# Altium schematic sheet AUDIO.SchDoc
size A4
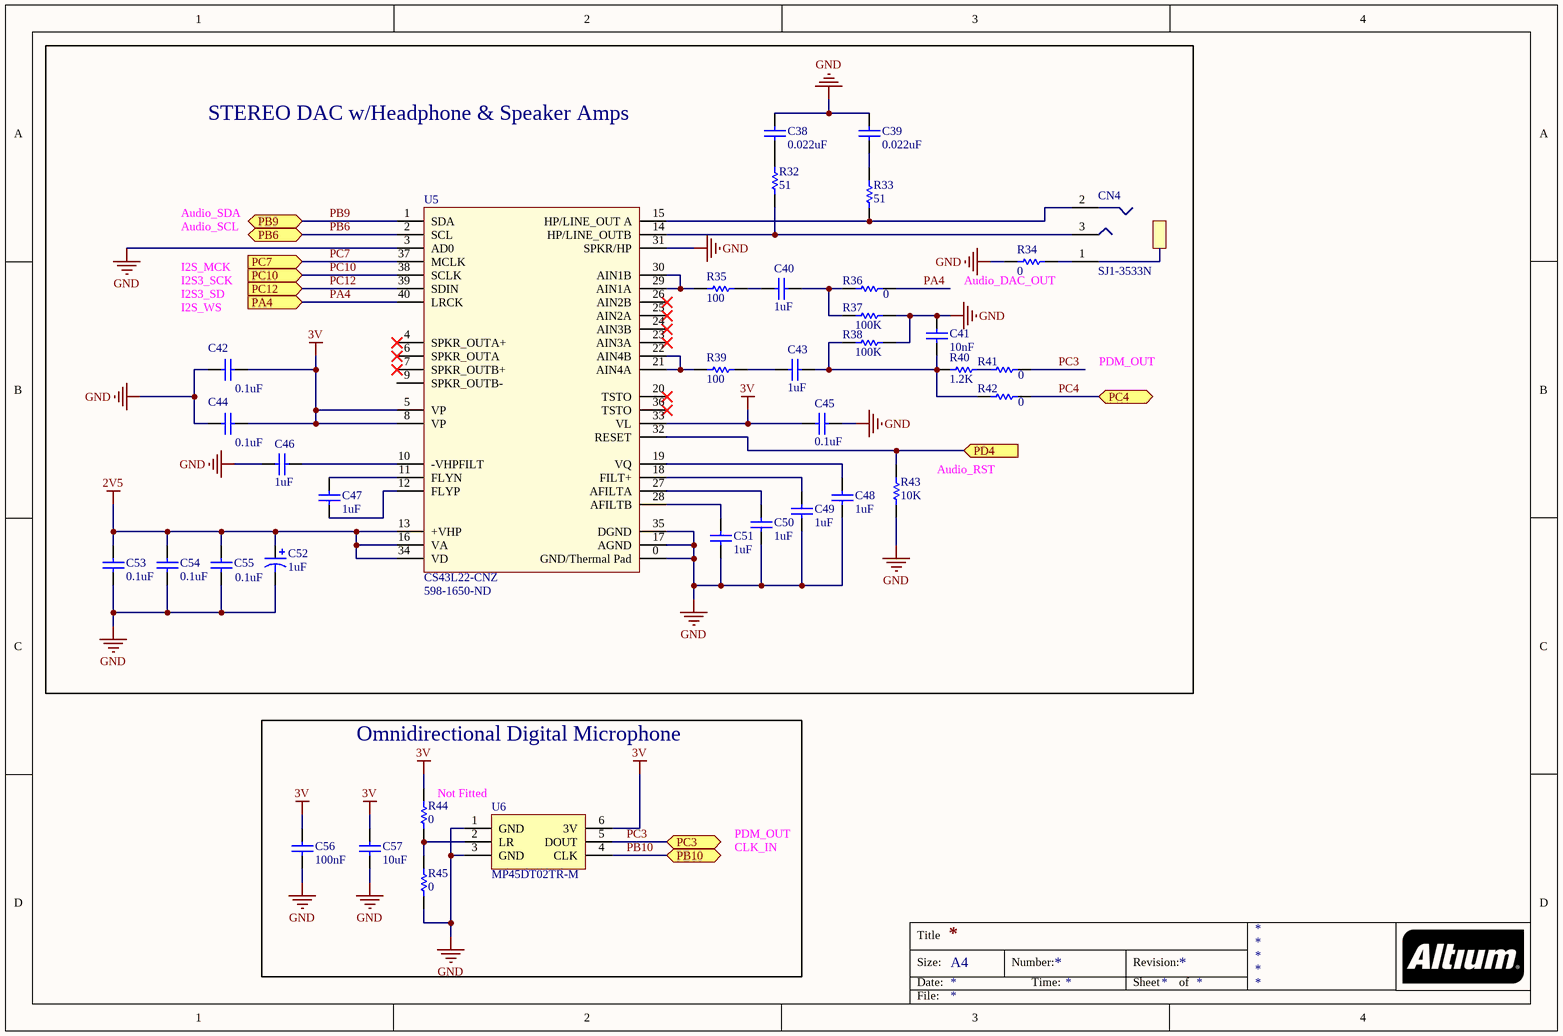
[diagram p0: AUDIO.SchDoc]

## Parts
C38  value 0.022uF  [CAPC0402B]  (hidden comment: Cap)
C39  value 0.022uF  [CAPC0402B]  (hidden comment: Cap)
C40  value 1uF  [CAPC0603B]  (hidden comment: Cap)
C41  value 10nF  [CAPC0402B]  (hidden comment: Cap)
C42  value 0.1uF  [CAPC0402B]  (hidden comment: Cap)
C43  value 1uF  [CAPC0603B]  (hidden comment: Cap)
C44  value 0.1uF  [CAPC0402B]  (hidden comment: Cap)
C45  value 0.1uF  [CAPC0402B]  (hidden comment: Cap)
C46  value 1uF  [CAPC0603B]  (hidden comment: Cap)
C47  value 1uF  [CAPC0603B]  (hidden comment: Cap)
C48  value 1uF  [CAPC0603B]  (hidden comment: Cap)
C49  value 1uF  [CAPC0603B]  (hidden comment: Cap)
C50  value 1uF  [CAPC0603B]  (hidden comment: Cap)
C51  value 1uF  [CAPC0603B]  (hidden comment: Cap)
C52  value 1uF  [TANTALUM CASE A_LEVEL B]  (hidden comment: Cap Pol1)
C53  value 0.1uF  [CAPC0402B]  (hidden comment: Cap)
C54  value 0.1uF  [CAPC0402B]  (hidden comment: Cap)
C55  value 0.1uF  [CAPC0402B]  (hidden comment: Cap)
C56  value 100nF  [CAPC0603B]  (hidden comment: Cap)
C57  value 10uF  [CAPC0402B]  (hidden comment: Cap)
CN4  SJ1-3533N  [SJ1-3533N]
R32  value 51  [RESC0402B]  (hidden comment: Res1)
R33  value 51  [RESC0402B]  (hidden comment: Res1)
R34  value 0  [RESC0603B]  (hidden comment: Res1)
R35  value 100  [RESC0402B]  (hidden comment: Res1)
R36  value 0  [RESC0603B]  (hidden comment: Res1)
R37  value 100K  [RESC0402B]  (hidden comment: Res1)
R38  value 100K  [RESC0402B]  (hidden comment: Res1)
R39  value 100  [RESC0402B]  (hidden comment: Res1)
R40  value 1.2K  [RESC0402B]  (hidden comment: Res1)
R41  value 0  [RESC0603B]  (hidden comment: Res1)
R42  value 0  [RESC0603B]  (hidden comment: Res1)
R43  value 10K  [RESC0603B]  (hidden comment: Res1)
R44  value 0  [RESC0603B]  (hidden comment: Res1)
R45  value 0  [RESC0603B]  (hidden comment: Res1)
U5  CS43L22-CNZ  Supplier Part Number 1: 598-1650-ND  [40QFN]
U6  MP45DT02TR-M  [MP45DT02TR]

## Blocks framed on the sheet
STEREO DAC w/Headphone & Speaker Amps: C38-C55 CN4 R32-R43 U5
Omnidirectional Digital Microphone: C56 C57 R44 R45 U6

## Ports
PA4 (in), PB6 (bidir), PB9 (bidir), PB10 (bidir), PC3 (bidir), PC4 (bidir), PC7 (in), PC10 (in), PC12 (in), PD4 (in)

## Nets
2V5: C52.1 C53.2 C54.2 C55.2 U5.13(+VHP) U5.16(VA) U5.34(VD)
3V: C42.2 C44.2 C45.2 C56.2 C57.2 R44.2 U5.5(VP) U5.8(VP) U5.33(VL) U6.6(3V)
GND: C38.2 C39.2 C41.2 C42.1 C44.1 C45.1 C46.1 C48.2 C49.2 C50.2 C51.1 C52.2 C53.1 C54.1 C55.1 C56.1 C57.1 R34.1 R37.2 R38.2 R43.1 R45.1 U5.0(GND/Thermal_Pad) U5.3(AD0) U5.17(AGND) U5.31(SPKR/HP) U5.35(DGND) U6.1(GND) U6.3(GND)
PA4: R36.2 U5.40(LRCK) ; port PA4
PB6: U5.2(SCL) ; port PB6
PB9: U5.1(SDA) ; port PB9
PB10: U6.4(CLK) ; port PB10
PC3: R41.2 U6.5(DOUT) ; port PC3
PC4: R42.2 ; port PC4
PC7: U5.37(MCLK) ; port PC7
PC10: U5.38(SCLK) ; port PC10
PC12: U5.39(SDIN) ; port PC12
PD4: R43.2 U5.32(RESET) ; port PD4
NetC38_1: C38.1 R32.2
NetC39_1: C39.1 R33.2
NetC40_1: C40.1 R35.1
NetC40_2: C40.2 R36.1 R37.1
NetC41_1: C41.1 C43.2 R38.1 R40.1 R42.1
NetC43_1: C43.1 R39.1
NetC46_2: C46.2 U5.10(-VHPFILT)
NetC47_1: C47.1 U5.12(FLYP)
NetC47_2: C47.2 U5.11(FLYN)
NetC48_1: C48.1 U5.19(VQ)
NetC49_1: C49.1 U5.18(FILT+)
NetC50_1: C50.1 U5.27(AFILTA)
NetC51_2: C51.2 U5.28(AFILTB)
NetCN4_1: CN4.1 R34.2
NetCN4_2: CN4.2 R33.1 U5.15(HP/LINE_OUT_A)
NetCN4_3: CN4.3 R32.1 U5.14(HP/LINE_OUTB)
NetR35_2: R35.2 U5.29(AIN1A) U5.30(AIN1B)
NetR39_2: R39.2 U5.21(AIN4A) U5.22(AIN4B)
NetR40_2: R40.2 R41.1
NetR44_1: R44.1 R45.2 U6.2(LR)

Not connected (* = marked no-connect by the designer): U5 4(SPKR_OUTA+)* 6(SPKR_OUTA)* 7(SPKR_OUTB+)* 9(SPKR_OUTB-) 20(TSTO)* 23(AIN3A)* 24(AIN3B)* 25(AIN2A)* 26(AIN2B)* 36(TSTO)*

## Notes on the sheet
- Audio_SDA
- Audio_SCL
- I2S_MCK
- I2S3_SCK
- I2S3_SD
- I2S_WS
- (near R34) Audio_DAC_OUT
- PDM_OUT
- (near R43) Audio_RST
- (near R44) Not Fitted
- CLK_IN
- Title
- Size:
- Date:
- A4
- Number:
- Time:
- Revision:
- Sheet
- of
- File:

## Library data of the parts
C38 C39 = Cap_8: Capacitor; Published: 8-Jun-2000; LatestRevisionDate: 17-Jul-2002; LatestRevisionNote: Re-released for DXP Platform.; PackageReference: RAD-0.3; Publisher: Altium Limited; PackageDescription: Radial Cap, Thru-Hole; 2 Leads; 0.3 in Pin Spacing
C40 C43 C46-C51 = Cap_4: Capacitor; Published: 8-Jun-2000; LatestRevisionDate: 17-Jul-2002; LatestRevisionNote: Re-released for DXP Platform.; PackageReference: RAD-0.3; Publisher: Altium Limited; PackageDescription: Radial Cap, Thru-Hole; 2 Leads; 0.3 in Pin Spacing
C41 = Cap_7: Capacitor; Published: 8-Jun-2000; LatestRevisionDate: 17-Jul-2002; LatestRevisionNote: Re-released for DXP Platform.; PackageReference: RAD-0.3; Publisher: Altium Limited; PackageDescription: Radial Cap, Thru-Hole; 2 Leads; 0.3 in Pin Spacing
C42 C44 C45 C53-C55 = Cap_6: Capacitor; Published: 8-Jun-2000; LatestRevisionDate: 17-Jul-2002; LatestRevisionNote: Re-released for DXP Platform.; PackageReference: RAD-0.3; Publisher: Altium Limited; PackageDescription: Radial Cap, Thru-Hole; 2 Leads; 0.3 in Pin Spacing
C52 = Cap Pol1: Polarized Capacitor (Radial); Published: 8-Jun-2000; LatestRevisionDate: 17-Jul-2002; LatestRevisionNote: Re-released for DXP Platform.; PackageReference: RB7.6-15; Publisher: Altium Limited; PackageDescription: Polarized Capacitor (Radial); 2 Leads
C56 = Cap_3: Capacitor; Published: 8-Jun-2000; LatestRevisionDate: 17-Jul-2002; LatestRevisionNote: Re-released for DXP Platform.; PackageReference: RAD-0.3; Publisher: Altium Limited; PackageDescription: Radial Cap, Thru-Hole; 2 Leads; 0.3 in Pin Spacing
C57 = Cap_5: Capacitor; Published: 8-Jun-2000; LatestRevisionDate: 17-Jul-2002; LatestRevisionNote: Re-released for DXP Platform.; PackageReference: RAD-0.3; Publisher: Altium Limited; PackageDescription: Radial Cap, Thru-Hole; 2 Leads; 0.3 in Pin Spacing
CN4 = PHONE JACK 3.5mm: 3.50mm (0.141", 1/8", Mini Plug) - Headphone Phone Jack Stereo Connector Solder; Manufacturer: CUI; Gender: Female; Actual Diameter: 0.142" (3.60mm); Number of Positions/Contacts: 3 Conductors, 3 Contacts; Internal Switch(s): Does Not Contain Switch; Shielding: Unshielded; Voltage - Rated: 12VDC; Current Rating: 1A; Mating Length/Depth: 0.551" (14.00mm); Body Material: Brass; Body Color: Silver, Black; Includes: 1 pc - 1 Connector; Supplier 1: Digikey; Manufacturer Part Number: SJ1-3533N; Stock 1: 8782; Pricing 1: 1=1.22, 10=1.076, 25=1.0128, 50=0.9706, 100=0.9284, 250=0.844, 500=0.7596, 1000=0.6752, 2500=0.6119 (USD); Category: Connectors, Interconnects; Family: Barrel - Audio Connectors; Series: SJ1; Packaging: Bulk; Connector Type: Phone Jack; Signal Lines: Stereo; Industry Recognized Mating Diameter: 3.50mm (0.141", 1/8", Mini Plug) - Headphone; Mounting Type: Through Hole, Right Angle; Termination: Solder; Features: -; Insulation Color: -; Contact Material - Plating: Tin; ComponentLink1URL: https://datasheet.ciiva.com/16381/sj1-353xn-series-16381818.pdf; ComponentLink1Description: https://datasheet.ciiva.com/16381/sj1-353xn-series-16381818.pdf
R32 R33 = Res1_8: Resistor; Published: 8-Jun-2000; LatestRevisionDate: 17-Jul-2002; LatestRevisionNote: Re-released for DXP Platform.; PackageReference: AXIAL-0.3; Publisher: Altium Limited; PackageDescription: Axial Device, Thru-Hole; 2 Leads; 0.3 in Pin Spacing
R34 R36 R41 R42 R44 R45 = Res1: Resistor; Published: 8-Jun-2000; LatestRevisionDate: 17-Jul-2002; LatestRevisionNote: Re-released for DXP Platform.; PackageReference: AXIAL-0.3; Publisher: Altium Limited; PackageDescription: Axial Device, Thru-Hole; 2 Leads; 0.3 in Pin Spacing
R35 R39 = Res1_4: Resistor; Published: 8-Jun-2000; LatestRevisionDate: 17-Jul-2002; LatestRevisionNote: Re-released for DXP Platform.; PackageReference: AXIAL-0.3; Publisher: Altium Limited; PackageDescription: Axial Device, Thru-Hole; 2 Leads; 0.3 in Pin Spacing
R37 R38 = Res1_5: Resistor; Published: 8-Jun-2000; LatestRevisionDate: 17-Jul-2002; LatestRevisionNote: Re-released for DXP Platform.; PackageReference: AXIAL-0.3; Publisher: Altium Limited; PackageDescription: Axial Device, Thru-Hole; 2 Leads; 0.3 in Pin Spacing
R40 = Res1_7: Resistor; Published: 8-Jun-2000; LatestRevisionDate: 17-Jul-2002; LatestRevisionNote: Re-released for DXP Platform.; PackageReference: AXIAL-0.3; Publisher: Altium Limited; PackageDescription: Axial Device, Thru-Hole; 2 Leads; 0.3 in Pin Spacing
R43 = Res1_2: Resistor; Published: 8-Jun-2000; LatestRevisionDate: 17-Jul-2002; LatestRevisionNote: Re-released for DXP Platform.; PackageReference: AXIAL-0.3; Publisher: Altium Limited; PackageDescription: Axial Device, Thru-Hole; 2 Leads; 0.3 in Pin Spacing
U5 = CS43L22-CNZ: Manufacturer: Cirrus Logic; PCN Assembly/Origin: Assembly/Test Supplier Transfer 06/Feb/2014 Assembly/Test Site Transfer Jun/2014 Assembly/Test Site Revision 01/Aug/2014; EDA / CAD Models: Download from Accelerated Designs; Resolution (Bits): 24 b; Sampling Rate (Per Second): 96k; Data Interface: I²S; Voltage Supply Source: Analog and Digital; Voltage - Supply: 1.65 V ~ 2.63 V; Online Catalog: Audio, Video; For Use With: 598-1529-ND                                                          - BOARD EVAL FOR CS43L22; Other Names: 598-1650  CS43L22CNZ; Supplier 1: Digikey; Manufacturer Part Number: CS43L22-CNZ; Stock 1: 3643; Pricing 1: 1=5.96, 10=5.325, 25=4.7924, 100=4.3665, 250=3.9405, 500=3.5358, 1000=2.982, 2500=2.8329 (USD); Standard Package: 50; Category: Integrated Circuits (ICs); Family: Data Acquisition - ADCs/DACs - Special Purpose; Series: -; Packaging: Tray; Type: DAC, Audio; Operating Temperature: -40°C ~ 85°C; Mounting Type: Surface Mount; Package / Case: 40-VFQFN Exposed Pad; Supplier Device Package: 40-QFN (6x6); ComponentLink1URL: https://datasheet.ciiva.com/1494/91818-1494314.pdf; ComponentLink1Description: https://datasheet.ciiva.com/1494/91818-1494314.pdf; ComponentLink2URL: https://datasheet.ciiva.com/6665/cs43l22-f2-6665692.pdf; ComponentLink2Description: https://datasheet.ciiva.com/6665/cs43l22-f2-6665692.pdf; ComponentLink3URL: https://datasheet.ciiva.com/3040/cs43l22-f2-3040429.pdf; ComponentLink3Description: https://datasheet.ciiva.com/3040/cs43l22-f2-3040429.pdf; ComponentLink4URL: https://datasheet.ciiva.com/16606/cs43l22-f2-16606863.pdf; ComponentLink4Description: https://datasheet.ciiva.com/16606/cs43l22-f2-16606863.pdf; ComponentLink5URL: https://datasheet.ciiva.com/26802/cs43l22-cnz-26802243.pdf; ComponentLink5Description: https://datasheet.ciiva.com/26802/cs43l22-cnz-26802243.pdf
U6 = MP45DT02TR